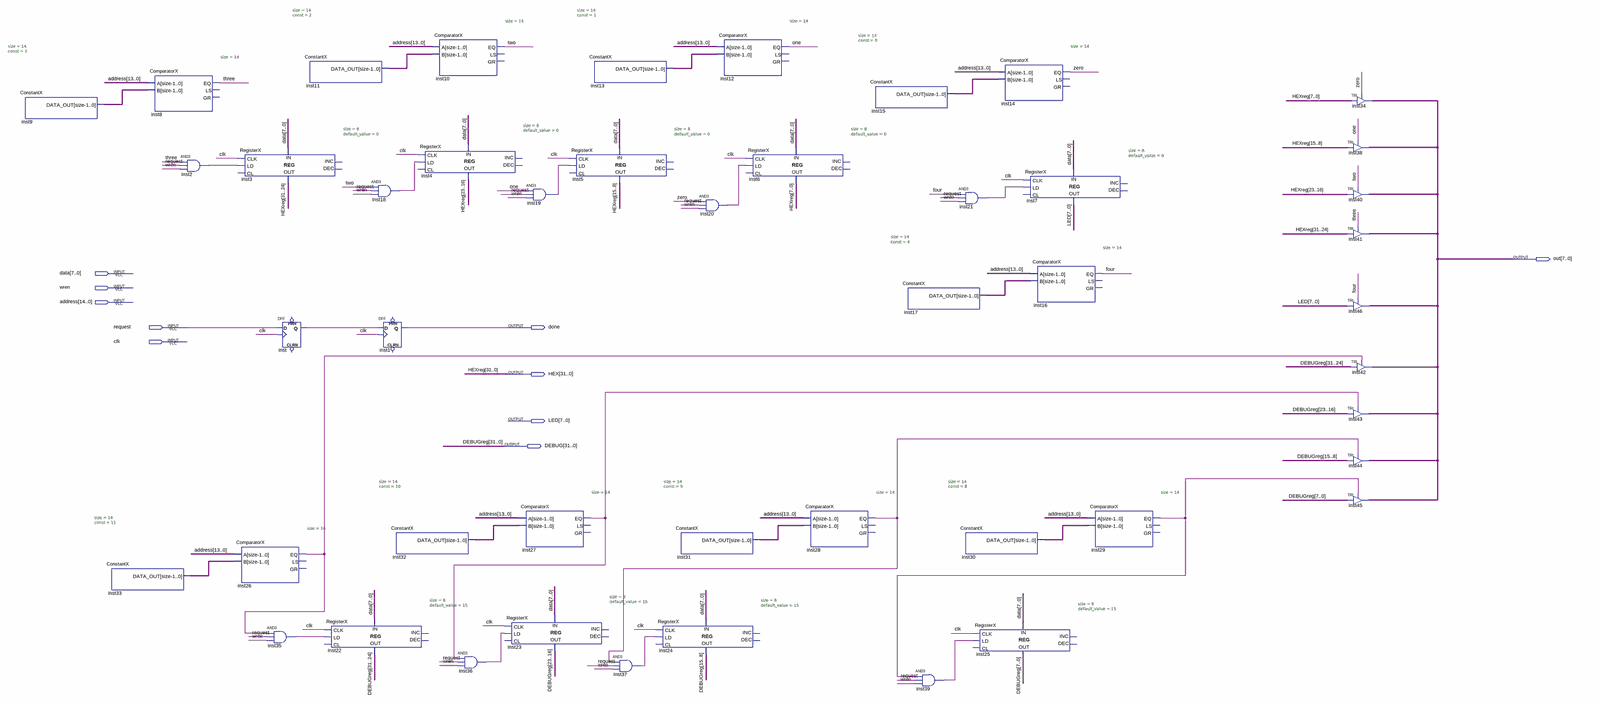
[diagram p0: schematic sheet, whole]
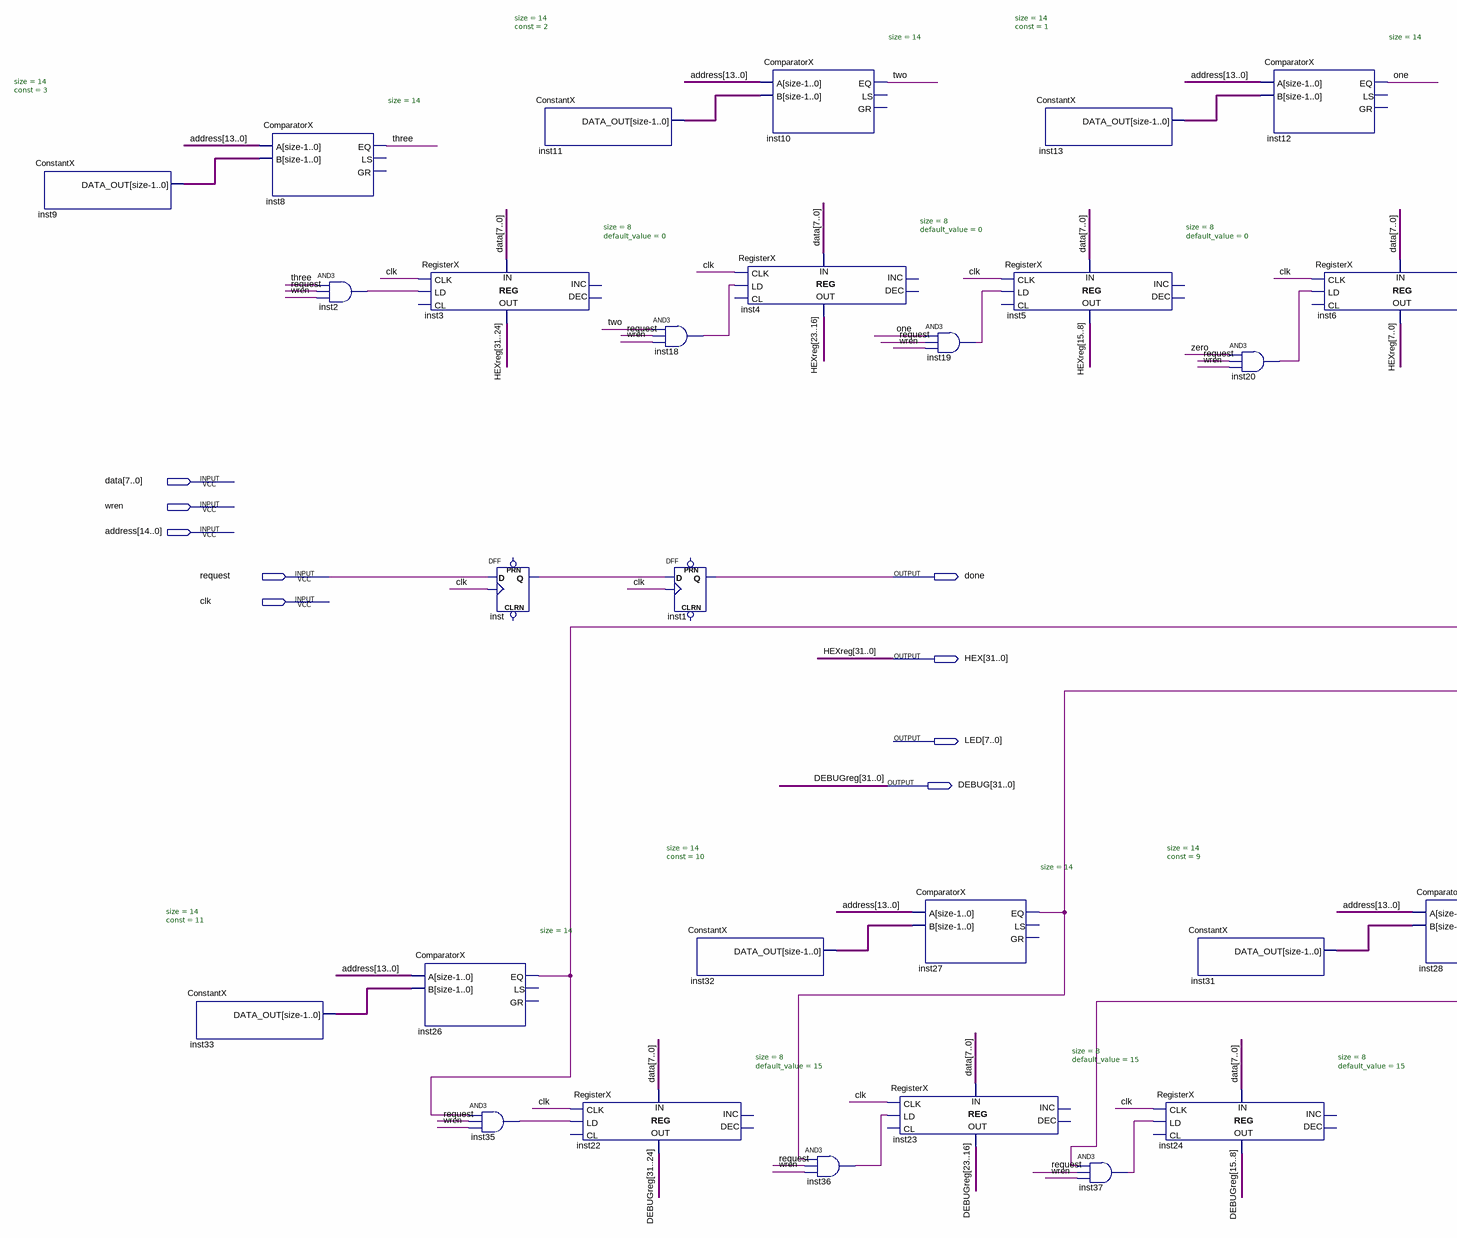
[diagram p1: schematic sheet, left part]
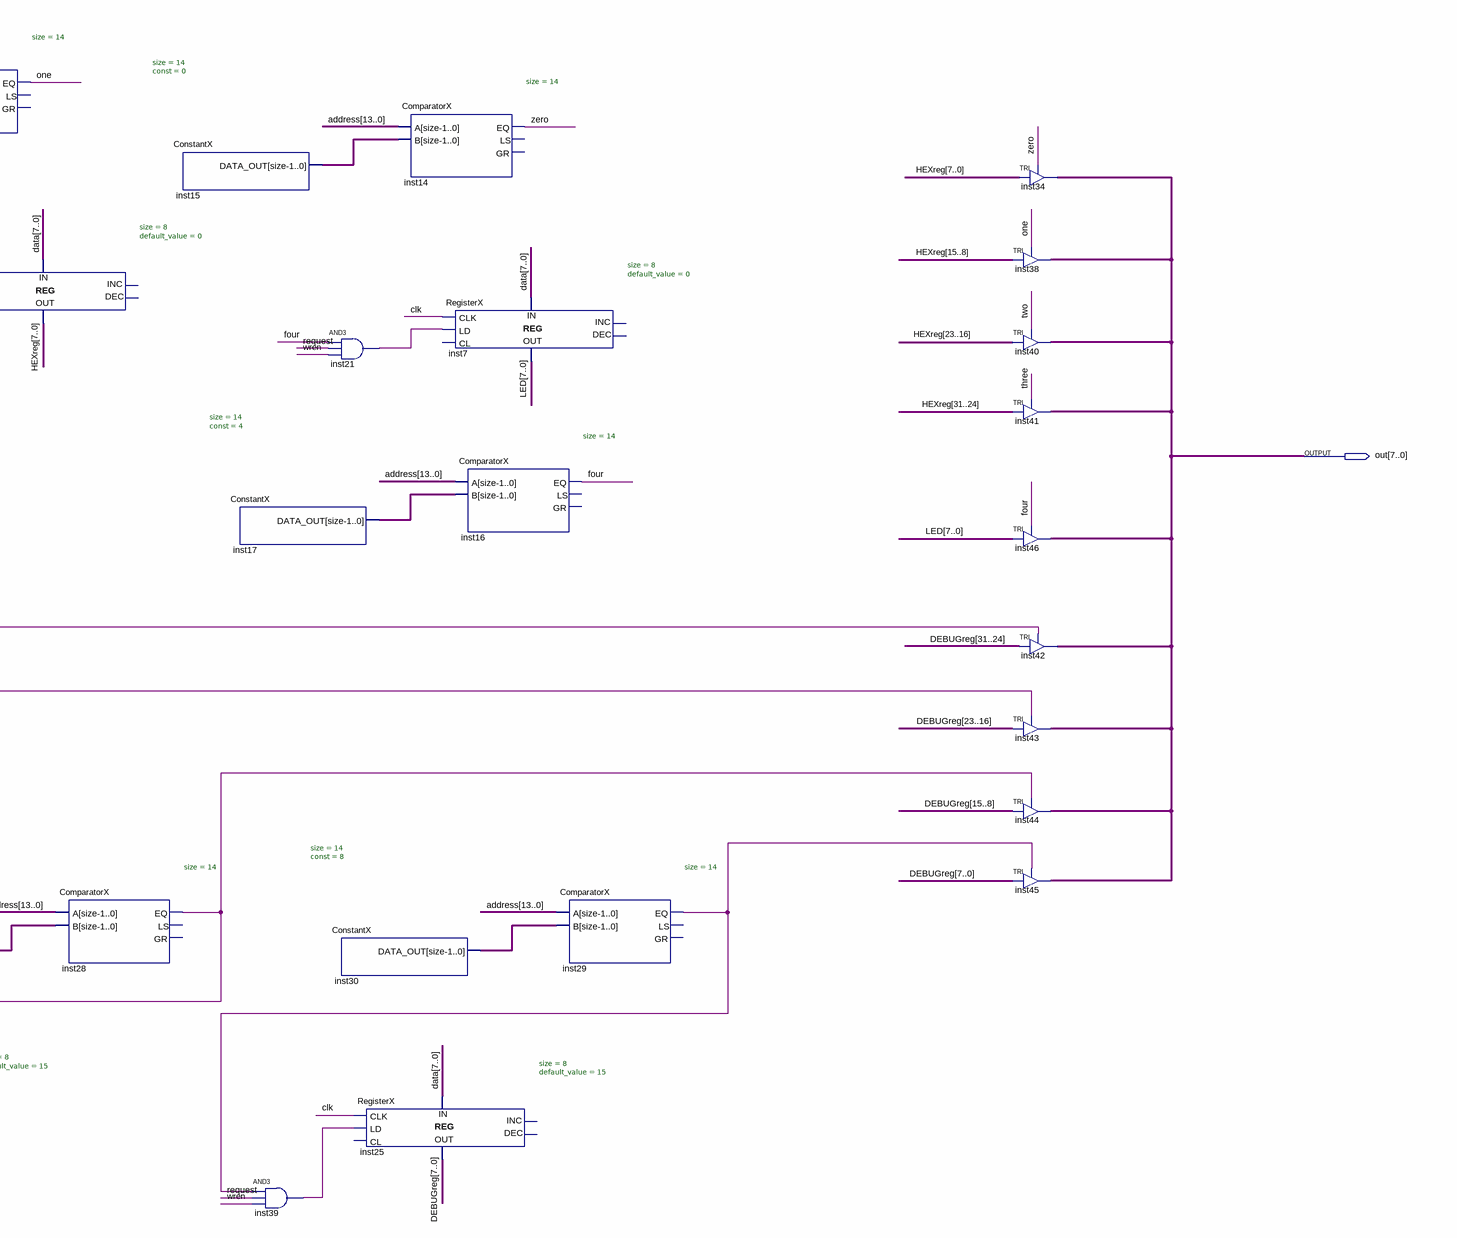
[diagram p2: schematic sheet, right part]
// Quartus schematic HexLedRAM.bdf as structural Verilog: 47 symbols, 10 pins
module HexLedRAM (
  input  [7:0] data,
  input  wren,
  input  [14:0] address,
  input  request,
  input  clk,
  output [7:0] out,
  output done,
  output [31:0] HEX,
  output [7:0] LED,
  output [31:0] DEBUG
);

  wire four, inst2_out, inst18_out, inst19_out, inst20_out, inst21_out, inst26_eq, inst27_eq, inst28_eq,
       inst29_eq, inst35_out, inst36_out, inst37_out, inst39_out, inst_q, one, three, two, zero;
  wire [13:0] inst9_data_out, inst11_data_out, inst13_data_out, inst15_data_out, inst17_data_out,
       inst30_data_out, inst31_data_out, inst32_data_out, inst33_data_out;

  ConstantX #(.size(14), .\const (3)) inst9 (.DATA_OUT(inst9_data_out));
  ConstantX #(.size(14), .\const (11)) inst33 (.DATA_OUT(inst33_data_out));
  ComparatorX #(.size(14)) inst8 (.A(address[13:0]), .B(inst9_data_out), .EQ(three));  // open: LS, GR
  and inst2 (inst2_out, three, request, wren);
  ComparatorX #(.size(14)) inst26 (.A(address[13:0]), .B(inst33_data_out), .EQ(inst26_eq));  // open: LS, GR
  RegisterX #(.size(8), .default_value(0)) inst3 (
    .CLK(clk), .LD(inst2_out), .DATA_IN(data), .DATA_OUT(HEX[31:24]));  // open: CL, INC, DEC
  DFF inst (.CLK(clk), .D(request), .Q(inst_q));  // open: CLRN, PRN
  and inst35 (inst35_out, inst26_eq, request, wren);
  ConstantX #(.size(14), .\const (2)) inst11 (.DATA_OUT(inst11_data_out));
  RegisterX #(.size(8), .default_value(15)) inst22 (
    .CLK(clk), .LD(inst35_out), .DATA_IN(data), .DATA_OUT(DEBUG[31:24]));  // open: CL, INC, DEC
  and inst18 (inst18_out, two, request, wren);
  DFF inst1 (.CLK(clk), .D(inst_q), .Q(done));  // open: CLRN, PRN
  ConstantX #(.size(14), .\const (10)) inst32 (.DATA_OUT(inst32_data_out));
  ComparatorX #(.size(14)) inst10 (.A(address[13:0]), .B(inst11_data_out), .EQ(two));  // open: LS, GR
  RegisterX #(.size(8), .default_value(0)) inst4 (
    .CLK(clk), .LD(inst18_out), .DATA_IN(data), .DATA_OUT(HEX[23:16]));  // open: CL, INC, DEC
  and inst36 (inst36_out, inst27_eq, request, wren);
  ComparatorX #(.size(14)) inst27 (.A(address[13:0]), .B(inst32_data_out), .EQ(inst27_eq));  // open: LS, GR
  RegisterX #(.size(8), .default_value(15)) inst23 (
    .CLK(clk), .LD(inst36_out), .DATA_IN(data), .DATA_OUT(DEBUG[23:16]));  // open: CL, INC, DEC
  and inst19 (inst19_out, one, request, wren);
  RegisterX #(.size(8), .default_value(0)) inst5 (
    .CLK(clk), .LD(inst19_out), .DATA_IN(data), .DATA_OUT(HEX[15:8]));  // open: CL, INC, DEC
  ConstantX #(.size(14), .\const (1)) inst13 (.DATA_OUT(inst13_data_out));
  and inst37 (inst37_out, inst28_eq, request, wren);
  RegisterX #(.size(8), .default_value(15)) inst24 (
    .CLK(clk), .LD(inst37_out), .DATA_IN(data), .DATA_OUT(DEBUG[15:8]));  // open: CL, INC, DEC
  ConstantX #(.size(14), .\const (9)) inst31 (.DATA_OUT(inst31_data_out));
  ComparatorX #(.size(14)) inst12 (.A(address[13:0]), .B(inst13_data_out), .EQ(one));  // open: LS, GR
  and inst20 (inst20_out, zero, request, wren);
  RegisterX #(.size(8), .default_value(0)) inst6 (
    .CLK(clk), .LD(inst20_out), .DATA_IN(data), .DATA_OUT(HEX[7:0]));  // open: CL, INC, DEC
  ComparatorX #(.size(14)) inst28 (.A(address[13:0]), .B(inst31_data_out), .EQ(inst28_eq));  // open: LS, GR
  ConstantX #(.size(14), .\const (0)) inst15 (.DATA_OUT(inst15_data_out));
  ConstantX #(.size(14), .\const (4)) inst17 (.DATA_OUT(inst17_data_out));
  and inst39 (inst39_out, inst29_eq, request, wren);
  and inst21 (inst21_out, four, request, wren);
  ConstantX #(.size(14), .\const (8)) inst30 (.DATA_OUT(inst30_data_out));
  RegisterX #(.size(8), .default_value(15)) inst25 (
    .CLK(clk), .LD(inst39_out), .DATA_IN(data), .DATA_OUT(DEBUG[7:0]));  // open: CL, INC, DEC
  ComparatorX #(.size(14)) inst14 (.A(address[13:0]), .B(inst15_data_out), .EQ(zero));  // open: LS, GR
  RegisterX #(.size(8), .default_value(0)) inst7 (
    .CLK(clk), .LD(inst21_out), .DATA_IN(data), .DATA_OUT(LED));  // open: CL, INC, DEC
  ComparatorX #(.size(14)) inst16 (.A(address[13:0]), .B(inst17_data_out), .EQ(four));  // open: LS, GR
  ComparatorX #(.size(14)) inst29 (.A(address[13:0]), .B(inst30_data_out), .EQ(inst29_eq));  // open: LS, GR
  TRI inst34[7:0] (.IN(HEX[7:0]), .OE(zero), .OUT(out));
  TRI inst38[7:0] (.IN(HEX[15:8]), .OE(one), .OUT(out));
  TRI inst40[7:0] (.IN(HEX[23:16]), .OE(two), .OUT(out));
  TRI inst41[7:0] (.IN(HEX[31:24]), .OE(three), .OUT(out));
  TRI inst46[7:0] (.IN(LED), .OE(four), .OUT(out));
  TRI inst42[7:0] (.IN(DEBUG[31:24]), .OE(inst26_eq), .OUT(out));
  TRI inst43[7:0] (.IN(DEBUG[23:16]), .OE(inst27_eq), .OUT(out));
  TRI inst44[7:0] (.IN(DEBUG[15:8]), .OE(inst28_eq), .OUT(out));
  TRI inst45[7:0] (.IN(DEBUG[7:0]), .OE(inst29_eq), .OUT(out));

  // Other names for the same wires on the sheet: DEBUGreg[31:0] = DEBUG; HEXreg[31:0] = HEX
endmodule
